# EAGLE schematic schema_backup_11_10 (EAGLE 9.6.2)
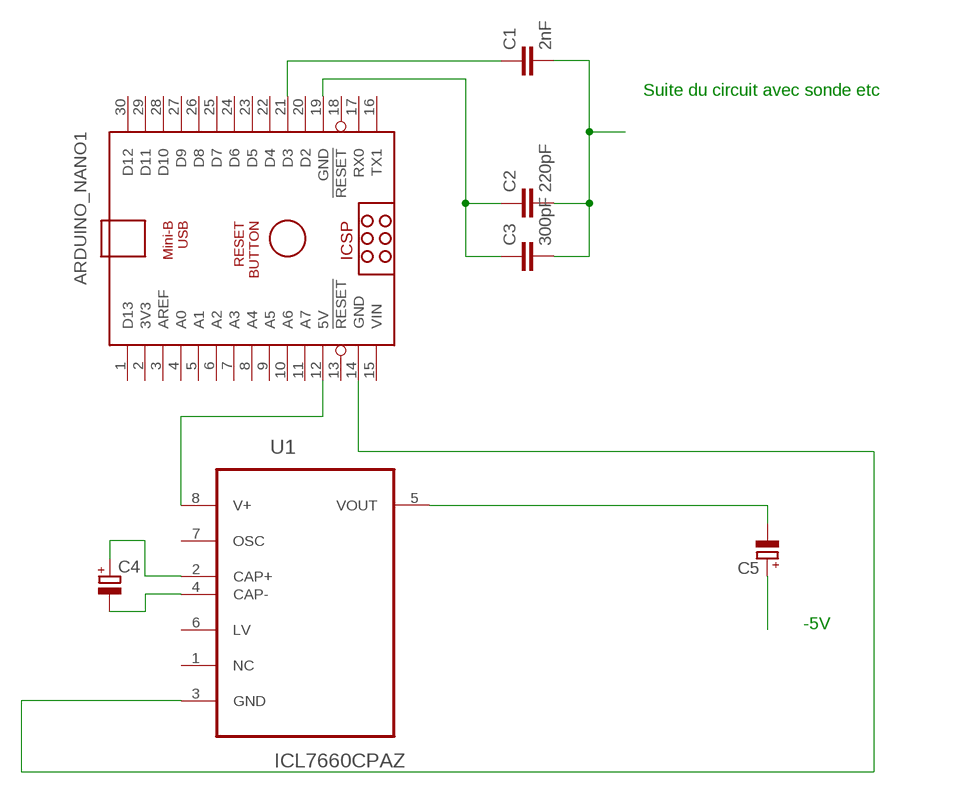
[diagram p0: schematic, sheet 1]

## Parts
ARDUINO_NANO1  ARDUINO_NANO  [ARDUINO_NANO]
C1  2nF  C2,5-3  [C2.5-3]
C2  220pF  C2,5-3  [C2.5-3]
C3  300pF  C2,5-3  [C2.5-3]
C4  CPOL-EU085CS-1AR  [085CS_1AR]
C5  CPOL-EU085CS-1AR  [085CS_1AR]
U1  ICL7660CPAZ  [DIP254P762X533-8]

## Nets
N$1: ARDUINO_NANO1.21(D3) C1.1
N$2: ARDUINO_NANO1.19(GND) C2.1 C3.1
N$3: C5.+
N$4: C5.- U1.5(VOUT)
N$5: ARDUINO_NANO1.12(5V) U1.8(V+)
N$6: C4.+ U1.2(CAP+)
N$7: C4.- U1.4(CAP-)
N$8: ARDUINO_NANO1.14(GND) U1.3(GND)
N$9: C1.2 C2.2 C3.2
Unconnected: ARDUINO_NANO1.1(D13) ARDUINO_NANO1.2(3V3) ARDUINO_NANO1.3(AREF) ARDUINO_NANO1.4(A0) ARDUINO_NANO1.5(A1) ARDUINO_NANO1.6(A2) ARDUINO_NANO1.7(A3) ARDUINO_NANO1.8(A4) ARDUINO_NANO1.9(A5) ARDUINO_NANO1.10(A6) ARDUINO_NANO1.11(A7) ARDUINO_NANO1.13(!RESET) ARDUINO_NANO1.16(TX1) ARDUINO_NANO1.17(RX0) ARDUINO_NANO1.18(!RESET) ARDUINO_NANO1.20(D2) ARDUINO_NANO1.22(D4) ARDUINO_NANO1.23(D5) ARDUINO_NANO1.24(D6) ARDUINO_NANO1.25(D7) ARDUINO_NANO1.26(D8) ARDUINO_NANO1.27(D9) ARDUINO_NANO1.28(D10) ARDUINO_NANO1.29(D11) ARDUINO_NANO1.30(D12) U1.1(NC) U1.6(LV) U1.7(OSC)

## Notes on the sheet
- Suite du circuit avec sonde etc
- -5V

## Power pins joined to a net without a drawn wire
VIN: ARDUINO_NANO1.15(VIN)

## Library data of the parts
ARDUINO_NANO1 = ArduinoNanoV30:ARDUINO_NANO: Arduino Nano V3.0 Overview: The Arduino Nano is a small, complete, and breadboard-friendly board based on the ATmega328 (Arduino Nano 3.x) or ATmega168 (Arduino Nano 2.x). It has more or less the same functionality of the Arduino Duemilanove, but in a different package. It lacks only a DC power jack, and works with a Mini-B USB cable instead of a standard one. The Nano was designed and is being produced by Gravitech. Specifications: Microcontroller Atmel ATmega168 or ATmega328 Operating Voltage (logic level) 5 V Input Voltage (recommended) 7-12 V Input Voltage (limits) 6-20 V Digital I/O Pins 14 (of which 6 provide PWM output) Analog Input Pins 8 DC Current per I/O Pin 40 mA Flash Memory 16 KB (ATmega168) or 32 KB (ATmega328) of which 2 KB used by bootloader SRAM 1 KB (ATmega168) or 2 KB (ATmega328) EEPROM 512 bytes (ATmega168) or 1 KB (ATmega328) Clock Speed 16 MHz Dimensions 0.73" x 1.70" Length 45 mm Width 18 mm Weigth 5 g Power: The Arduino Nano can be powered via the Mini-B USB connection, 6-20V unregulated external power supply (pin 30), or 5V regulated external power supply (pin 27). The power source is automatically selected to the highest voltage source. Memory: The ATmega168 has 16 KB of flash memory for storing code (of which 2 KB is used for the bootloader); the ATmega328 has 32 KB, (also with 2 KB used for the bootloader). The ATmega168 has 1 KB of SRAM and 512 bytes of EEPROM (which can be read and written with the EEPROM library); the ATmega328 has 2 KB of SRAM and 1 KB of EEPROM. Input and Output: Each of the 14 digital pins on the Nano can be used as an input or output, using pinMode(), digitalWrite(), and digitalRead() functions. They operate at 5 volts. Each pin can provide or receive a maximum of 40 mA and has an internal pull-up resistor (disconnected by default) of 20-50 kOhms. In addition, some pins have specialized functions. Visit Arduino - ArduinoBoardNano <https://www.arduino.cc/en/Main/ArduinoBoardNano>
C1-C3 = capacitor-wima:C: CAPACITOR naming: grid - package width
C4 C5 = rcl:CPOL-EU: POLARIZED CAPACITOR, European symbol; SPICEPREFIX: C
U1 = ICL7660CPAZ:ICL7660CPAZ: CMOS Voltage Converters Check availability <https://pricing.snapeda.com/parts/ICL7660CPAZ/Renesas%20Electronics/view-part?ref=eda>; AVAILABILITY: In Stock; CHECK_PRICES: https://www.snapeda.com/parts/ICL7660CPAZ/Renesas+Electronics+America+Inc./view-part/?ref=eda; DESCRIPTION: VOLT CONVERTER, 7660, DIP8; Voltage Regulator Type:Inverting; Voltage, Input Max:10V; Voltage, Output Max:-10V; Max Output Current:45mA; Voltage, Output Adjustable Max:-10V; Voltage, Output Adjustable Min:-1.5V; Frequency:10kHz; Voltage, Supply Min:1.5V; Voltage, Supply Max:10V; Termination Type:Through Hole; Case Style:DIP; No. of Pins:8; Operating Temperature Range:0°C to +70°C; Temp, Op. Max:70°C; Temp, Op. Min:0°C; Base Number:7660; IC Generic Number:7660; Logic Function Number:7660; Temperature Range, IC:Commercial; Voltage, Input Min:1.5V; Voltage, Output:22.8V; MF: Renesas Electronics; MP: ICL7660CPAZ; PACKAGE: DIP-8 Intersil; PRICE: None; PURCHASE-URL: https://www.snapeda.com/api/url_track_click_mouser/?unipart_id=587350&manufacturer=Renesas Electronics&part_name=ICL7660CPAZ&search_term=None; SNAPEDA_LINK: https://www.snapeda.com/parts/ICL7660CPAZ/Renesas+Electronics+America+Inc./view-part/?ref=snap